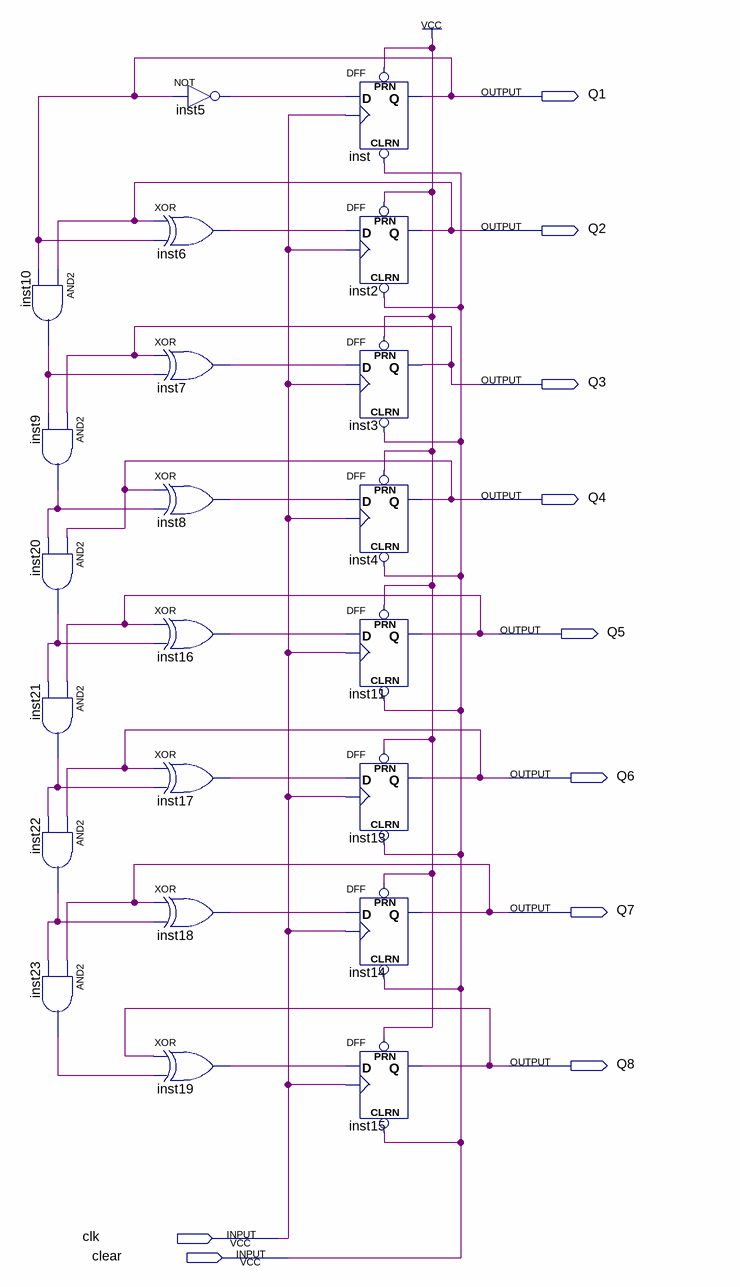
[diagram p0: schematic sheet]
// Quartus schematic sync_counter.bdf as structural Verilog: 22 symbols, 10 pins
module sync_counter (
  input  clk,
  input  clear,
  output Q1,
  output Q2,
  output Q3,
  output Q4,
  output Q5,
  output Q6,
  output Q7,
  output Q8
);

  wire inst5_out, inst6_out, inst7_out, inst8_out, inst9_out, inst10_out, inst16_out, inst17_out, inst18_out,
       inst19_out, inst20_out, inst21_out, inst22_out, inst23_out;

  and inst10 (inst10_out, Q2, Q1);
  and inst9 (inst9_out, Q3, inst10_out);
  and inst20 (inst20_out, Q4, inst9_out);
  and inst21 (inst21_out, Q5, inst20_out);
  and inst22 (inst22_out, Q6, inst21_out);
  and inst23 (inst23_out, Q7, inst22_out);
  xor inst6 (inst6_out, Q2, Q1);
  xor inst7 (inst7_out, Q3, inst10_out);
  xor inst8 (inst8_out, Q4, inst9_out);
  xor inst16 (inst16_out, Q5, inst20_out);
  xor inst17 (inst17_out, Q6, inst21_out);
  xor inst18 (inst18_out, Q7, inst22_out);
  xor inst19 (inst19_out, Q8, inst23_out);
  not inst5 (inst5_out, Q1);
  DFF inst (.CLRN(clear), .CLK(clk), .D(inst5_out), .PRN(1'b1), .Q(Q1));
  DFF inst2 (.CLRN(clear), .CLK(clk), .D(inst6_out), .PRN(1'b1), .Q(Q2));
  DFF inst3 (.CLRN(clear), .CLK(clk), .D(inst7_out), .PRN(1'b1), .Q(Q3));
  DFF inst4 (.CLRN(clear), .CLK(clk), .D(inst8_out), .PRN(1'b1), .Q(Q4));
  DFF inst11 (.CLRN(clear), .CLK(clk), .D(inst16_out), .PRN(1'b1), .Q(Q5));
  DFF inst13 (.CLRN(clear), .CLK(clk), .D(inst17_out), .PRN(1'b1), .Q(Q6));
  DFF inst14 (.CLRN(clear), .CLK(clk), .D(inst18_out), .PRN(1'b1), .Q(Q7));
  DFF inst15 (.CLRN(clear), .CLK(clk), .D(inst19_out), .PRN(1'b1), .Q(Q8));
endmodule
